# Altium schematic sheet FPGA.SchDoc: Grandmaster FPGA Connectors
size Tabloid; Author: N Smith; Revision: A; SheetNumber: 7; SheetTotal: 7; Customer: 01910
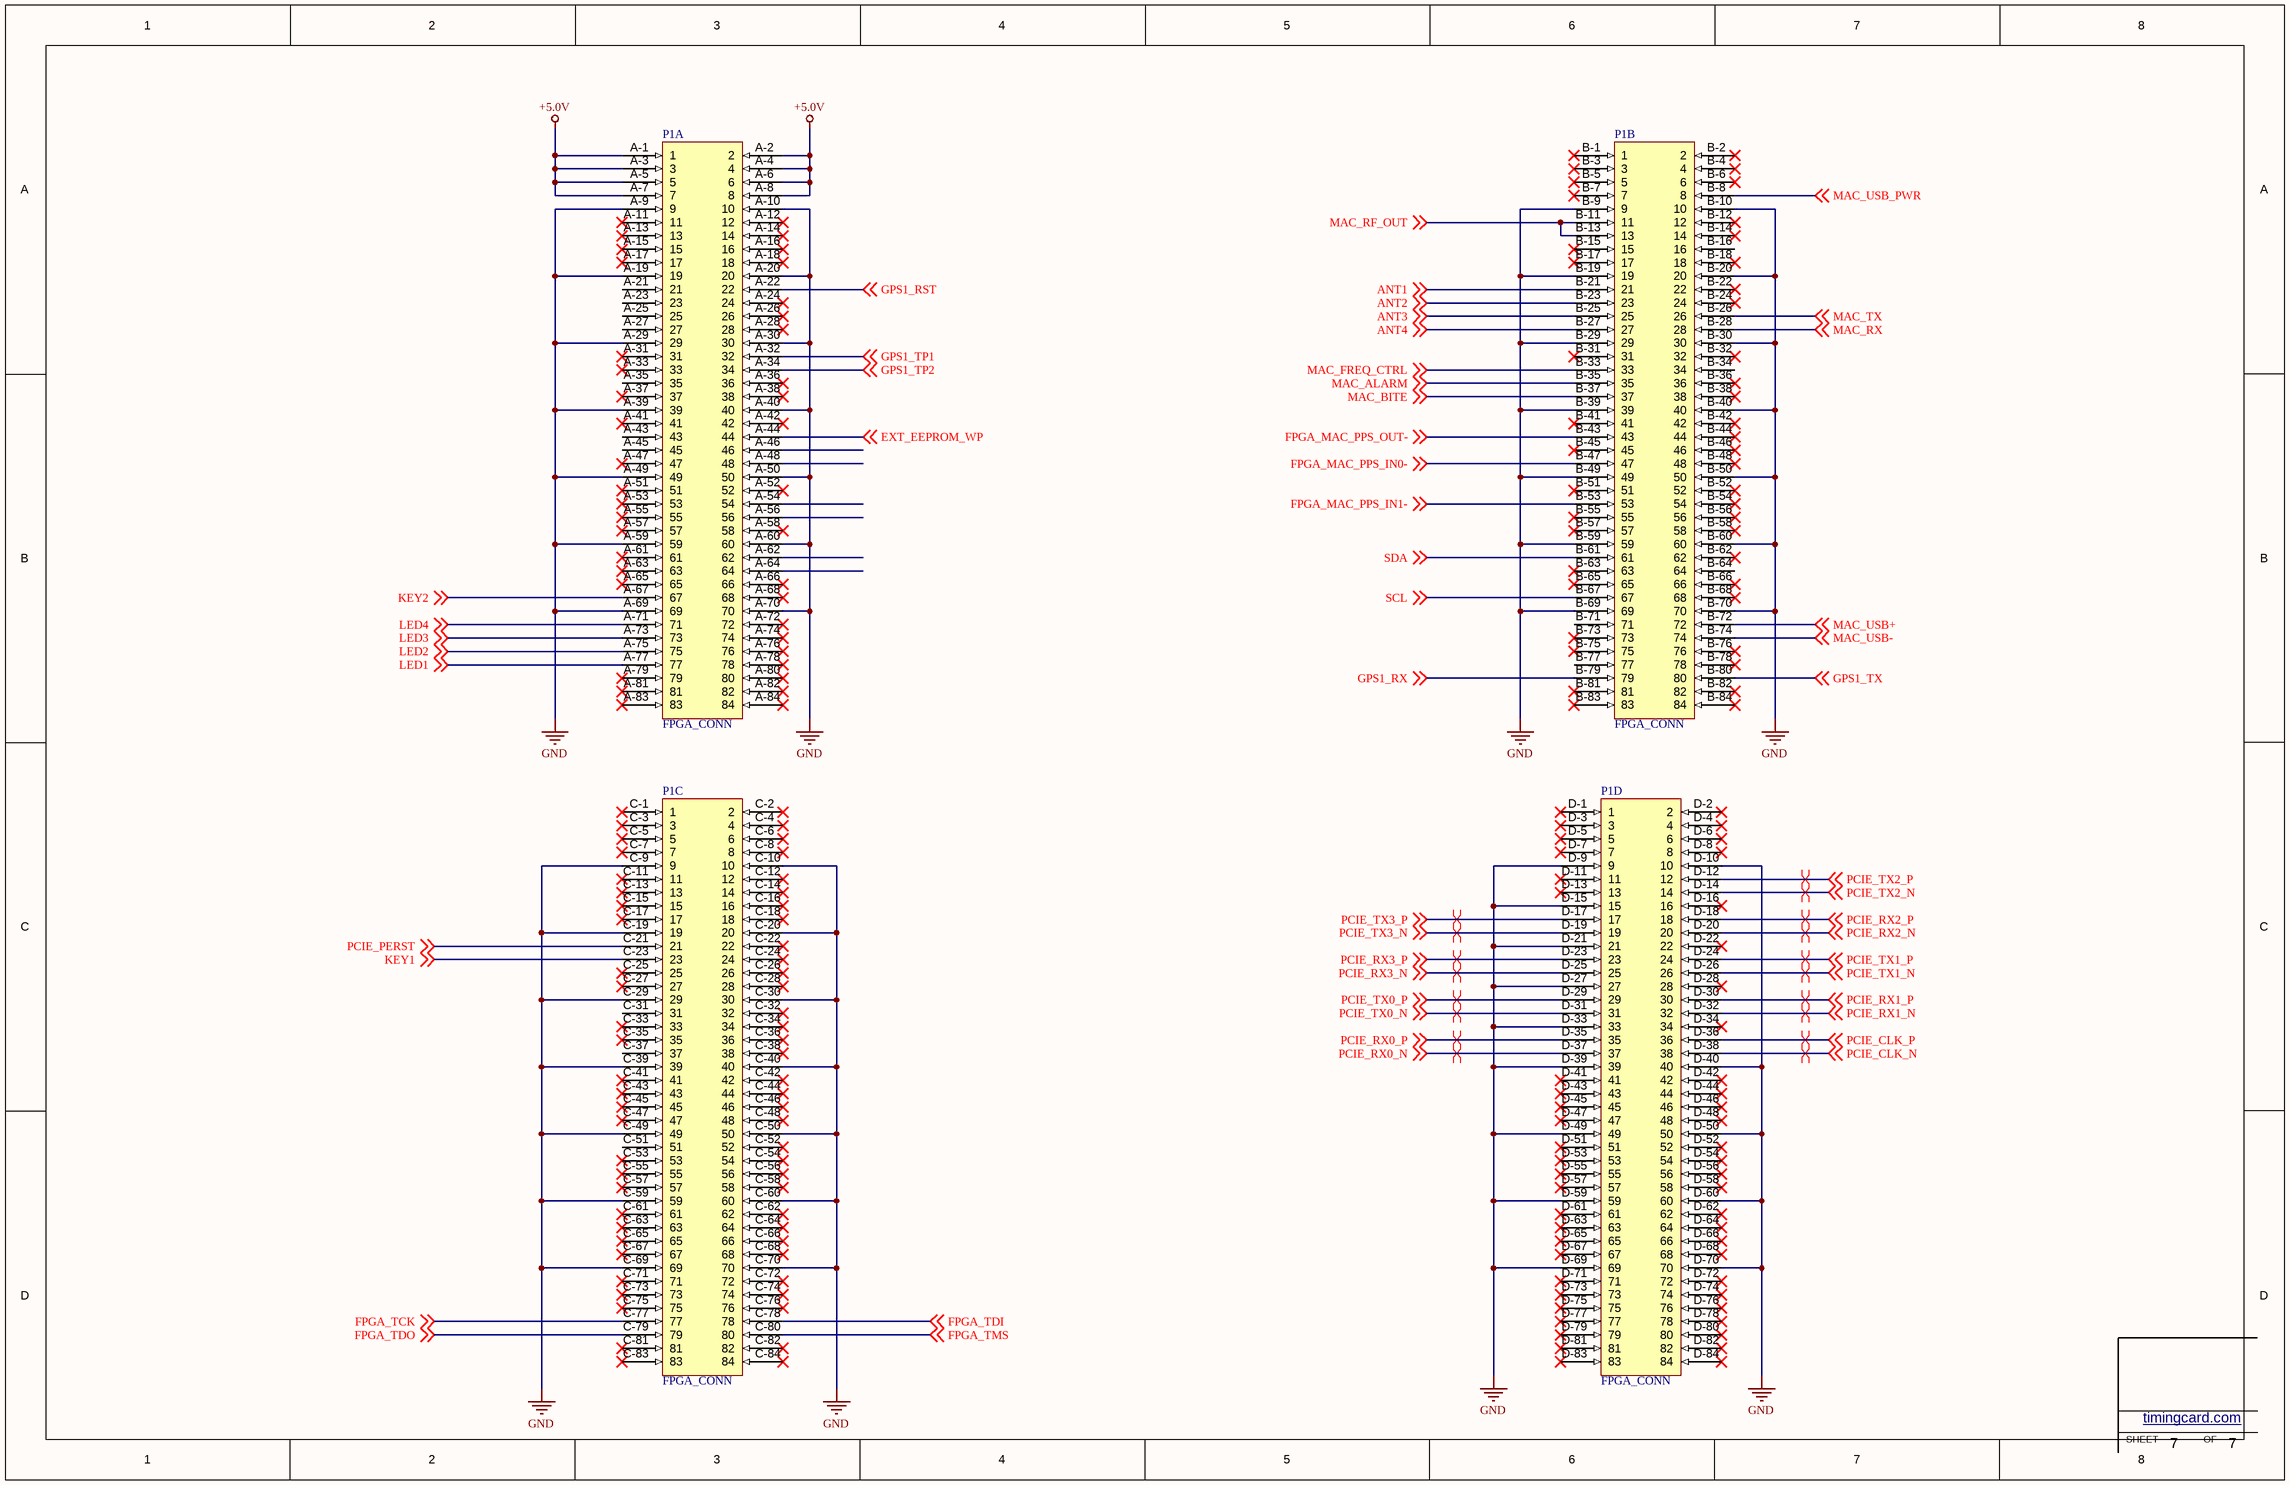
[diagram p0: FPGA.SchDoc]

## Parts
P1  FPGA_CONN  [FPGA_CONN]  (parts A,B,C,D of 4)

## Nets
+5.0V: P1.A-1(1) P1.A-2(2) P1.A-3(3) P1.A-4(4) P1.A-5(5) P1.A-6(6) P1.A-7(7) P1.A-8(8)
GND: P1.A-9(9) P1.A-10(10) P1.A-19(19) P1.A-20(20) P1.A-29(29) P1.A-30(30) P1.A-39(39) P1.A-40(40) P1.A-49(49) P1.A-50(50) P1.A-59(59) P1.A-60(60) P1.A-69(69) P1.A-70(70) P1.B-9(9) P1.B-10(10) P1.B-19(19) P1.B-20(20) P1.B-29(29) P1.B-30(30) P1.B-39(39) P1.B-40(40) P1.B-49(49) P1.B-50(50) P1.B-59(59) P1.B-60(60) P1.B-69(69) P1.B-70(70) P1.C-9(9) P1.C-10(10) P1.C-19(19) P1.C-20(20) P1.C-29(29) P1.C-30(30) P1.C-39(39) P1.C-40(40) P1.C-49(49) P1.C-50(50) P1.C-59(59) P1.C-60(60) P1.C-69(69) P1.C-70(70) P1.D-9(9) P1.D-10(10) P1.D-15(15) P1.D-21(21) P1.D-27(27) P1.D-33(33) P1.D-39(39) P1.D-40(40) P1.D-49(49) P1.D-50(50) P1.D-59(59) P1.D-60(60) P1.D-69(69) P1.D-70(70)
ANT1: P1.B-21(21) ; off-sheet ANT1
ANT2: P1.B-23(23) ; off-sheet ANT2
ANT3: P1.B-25(25) ; off-sheet ANT3
ANT4: P1.B-27(27) ; off-sheet ANT4
EXT_EEPROM_WP: P1.A-44(44) ; off-sheet EXT_EEPROM_WP
FPGA_MAC_PPS_IN0-: P1.B-47(47) ; off-sheet FPGA_MAC_PPS_IN0-
FPGA_MAC_PPS_IN1-: P1.B-53(53) ; off-sheet FPGA_MAC_PPS_IN1-
FPGA_MAC_PPS_OUT-: P1.B-43(43) ; off-sheet FPGA_MAC_PPS_OUT-
FPGA_TCK: P1.C-77(77) ; off-sheet FPGA_TCK
FPGA_TDI: P1.C-78(78) ; off-sheet FPGA_TDI
FPGA_TDO: P1.C-79(79) ; off-sheet FPGA_TDO
FPGA_TMS: P1.C-80(80) ; off-sheet FPGA_TMS
GPS1_RST: P1.A-22(22) ; off-sheet GPS1_RST
GPS1_RX: P1.B-79(79) ; off-sheet GPS1_RX
GPS1_TP1: P1.A-32(32) ; off-sheet GPS1_TP1
GPS1_TP2: P1.A-34(34) ; off-sheet GPS1_TP2
GPS1_TX: P1.B-80(80) ; off-sheet GPS1_TX
KEY1: P1.C-23(23) ; off-sheet KEY1
KEY2: P1.A-67(67) ; off-sheet KEY2
LED1: P1.A-77(77) ; off-sheet LED1
LED2: P1.A-75(75) ; off-sheet LED2
LED3: P1.A-73(73) ; off-sheet LED3
LED4: P1.A-71(71) ; off-sheet LED4
MAC_ALARM: P1.B-35(35) ; off-sheet MAC_ALARM
MAC_BITE: P1.B-37(37) ; off-sheet MAC_BITE
MAC_FREQ_CTRL: P1.B-33(33) ; off-sheet MAC_FREQ_CTRL
MAC_RF_OUT: P1.B-11(11) P1.B-13(13) ; off-sheet MAC_RF_OUT
MAC_RX: P1.B-28(28) ; off-sheet MAC_RX
MAC_TX: P1.B-26(26) ; off-sheet MAC_TX
MAC_USB+: P1.B-72(72) ; off-sheet MAC_USB+
MAC_USB-: P1.B-74(74) ; off-sheet MAC_USB-
MAC_USB_PWR: P1.B-8(8) ; off-sheet MAC_USB_PWR
PCIE_CLK_N: P1.D-38(38) ; off-sheet PCIE_CLK_N
PCIE_CLK_P: P1.D-36(36) ; off-sheet PCIE_CLK_P
PCIE_PERST: P1.C-21(21) ; off-sheet PCIE_PERST
PCIE_RX0_N: P1.D-37(37) ; off-sheet PCIE_RX0_N
PCIE_RX0_P: P1.D-35(35) ; off-sheet PCIE_RX0_P
PCIE_RX1_N: P1.D-32(32) ; off-sheet PCIE_RX1_N
PCIE_RX1_P: P1.D-30(30) ; off-sheet PCIE_RX1_P
PCIE_RX2_N: P1.D-20(20) ; off-sheet PCIE_RX2_N
PCIE_RX2_P: P1.D-18(18) ; off-sheet PCIE_RX2_P
PCIE_RX3_N: P1.D-25(25) ; off-sheet PCIE_RX3_N
PCIE_RX3_P: P1.D-23(23) ; off-sheet PCIE_RX3_P
PCIE_TX0_N: P1.D-31(31) ; off-sheet PCIE_TX0_N
PCIE_TX0_P: P1.D-29(29) ; off-sheet PCIE_TX0_P
PCIE_TX1_N: P1.D-26(26) ; off-sheet PCIE_TX1_N
PCIE_TX1_P: P1.D-24(24) ; off-sheet PCIE_TX1_P
PCIE_TX2_N: P1.D-14(14) ; off-sheet PCIE_TX2_N
PCIE_TX2_P: P1.D-12(12) ; off-sheet PCIE_TX2_P
PCIE_TX3_N: P1.D-19(19) ; off-sheet PCIE_TX3_N
PCIE_TX3_P: P1.D-17(17) ; off-sheet PCIE_TX3_P
SCL: P1.B-67(67) ; off-sheet SCL
SDA: P1.B-61(61) ; off-sheet SDA

Not connected (* = marked no-connect by the designer): P1 A-11(11)* A-12(12)* A-13(13)* A-14(14)* A-15(15)* A-16(16)* A-17(17)* A-18(18)* A-21(21) A-23(23) A-24(24)* A-25(25) A-26(26)* A-27(27) A-28(28)* A-31(31)* A-33(33)* A-35(35) A-36(36)* A-37(37)* A-38(38)* A-41(41)* A-42(42)* A-43(43) A-45(45) A-46(46) A-47(47)* A-48(48) A-51(51)* A-52(52)* A-53(53)* A-54(54) A-55(55)* A-56(56) A-57(57)* A-58(58)* A-61(61)* A-62(62) A-63(63)* A-64(64) A-65(65)* A-66(66)* A-68(68)* A-72(72)* A-74(74)* A-76(76)* A-78(78)* A-79(79)* A-80(80)* A-81(81)* A-82(82)* A-83(83)* A-84(84)* B-1(1)* B-2(2)* B-3(3)* B-4(4)* B-5(5)* B-6(6)* B-7(7)* B-12(12)* B-14(14)* B-15(15)* B-16(16) B-17(17)* B-18(18)* B-22(22)* B-24(24)* B-31(31)* B-32(32)* B-34(34) B-36(36)* B-38(38)* B-41(41)* B-42(42)* B-44(44)* B-45(45)* B-46(46)* B-48(48)* B-51(51)* B-52(52)* B-54(54)* B-55(55)* B-56(56)* B-57(57)* B-58(58)* B-62(62)* B-63(63)* B-64(64) B-65(65)* B-66(66)* B-68(68)* B-71(71) B-73(73)* B-75(75)* B-76(76)* B-77(77) B-78(78)* B-81(81)* B-82(82)* B-83(83)* B-84(84)* C-1(1)* C-2(2)* C-3(3)* C-4(4)* C-5(5)* C-6(6)* C-7(7)* C-8(8)* C-11(11)* C-12(12)* C-13(13)* C-14(14)* C-15(15)* C-16(16)* C-17(17)* C-18(18)* C-22(22)* C-24(24)* C-25(25)* C-26(26)* C-27(27)* C-28(28)* C-31(31) C-32(32)* C-33(33)* C-34(34)* C-35(35)* C-36(36)* C-37(37) C-38(38)* C-41(41)* C-42(42)* C-43(43)* C-44(44)* C-45(45)* C-46(46)* C-47(47)* C-48(48)* C-51(51) C-52(52)* C-53(53)* C-54(54)* C-55(55)* C-56(56)* C-57(57)* C-58(58)* C-61(61)* C-62(62)* C-63(63)* C-64(64)* C-65(65)* C-66(66)* C-67(67)* C-68(68)* C-71(71)* C-72(72)* C-73(73)* C-74(74)* C-75(75)* C-76(76)* C-81(81)* C-82(82)* C-83(83)* C-84(84)* D-1(1)* D-2(2)* D-3(3)* D-4(4)* D-5(5)* D-6(6)* D-7(7)* D-8(8)* D-11(11)* D-13(13)* D-16(16)* D-22(22)* D-28(28)* D-34(34)* D-41(41)* D-42(42)* D-43(43)* D-44(44)* D-45(45)* D-46(46)* D-47(47)* D-48(48)* D-51(51)* D-52(52)* D-53(53)* D-54(54)* D-55(55)* D-56(56)* D-57(57)* D-58(58)* D-61(61)* D-62(62)* D-63(63)* D-64(64)* D-65(65)* D-66(66)* D-67(67)* D-68(68)* D-71(71)* D-72(72)* D-73(73)* D-74(74)* D-75(75)* D-76(76)* D-77(77)* D-78(78)* D-79(79)* D-80(80)* D-81(81)* D-82(82)* D-83(83)* D-84(84)*

## Layout directives
differential pair: PCIE_CLK_N, PCIE_CLK_P, PCIE_RX0_N, PCIE_RX0_P, PCIE_RX1_N, PCIE_RX1_P, PCIE_RX2_N, PCIE_RX2_P, PCIE_RX3_N, PCIE_RX3_P, PCIE_TX0_N, PCIE_TX0_P, PCIE_TX1_N, PCIE_TX1_P, PCIE_TX2_N, PCIE_TX2_P, PCIE_TX3_N, PCIE_TX3_P

## Notes on the sheet
- SHEET
- timingcard.com <http://timingcard.com>
- OF